# EAGLE design raspdancer11_1.0 (EAGLE 6.4)
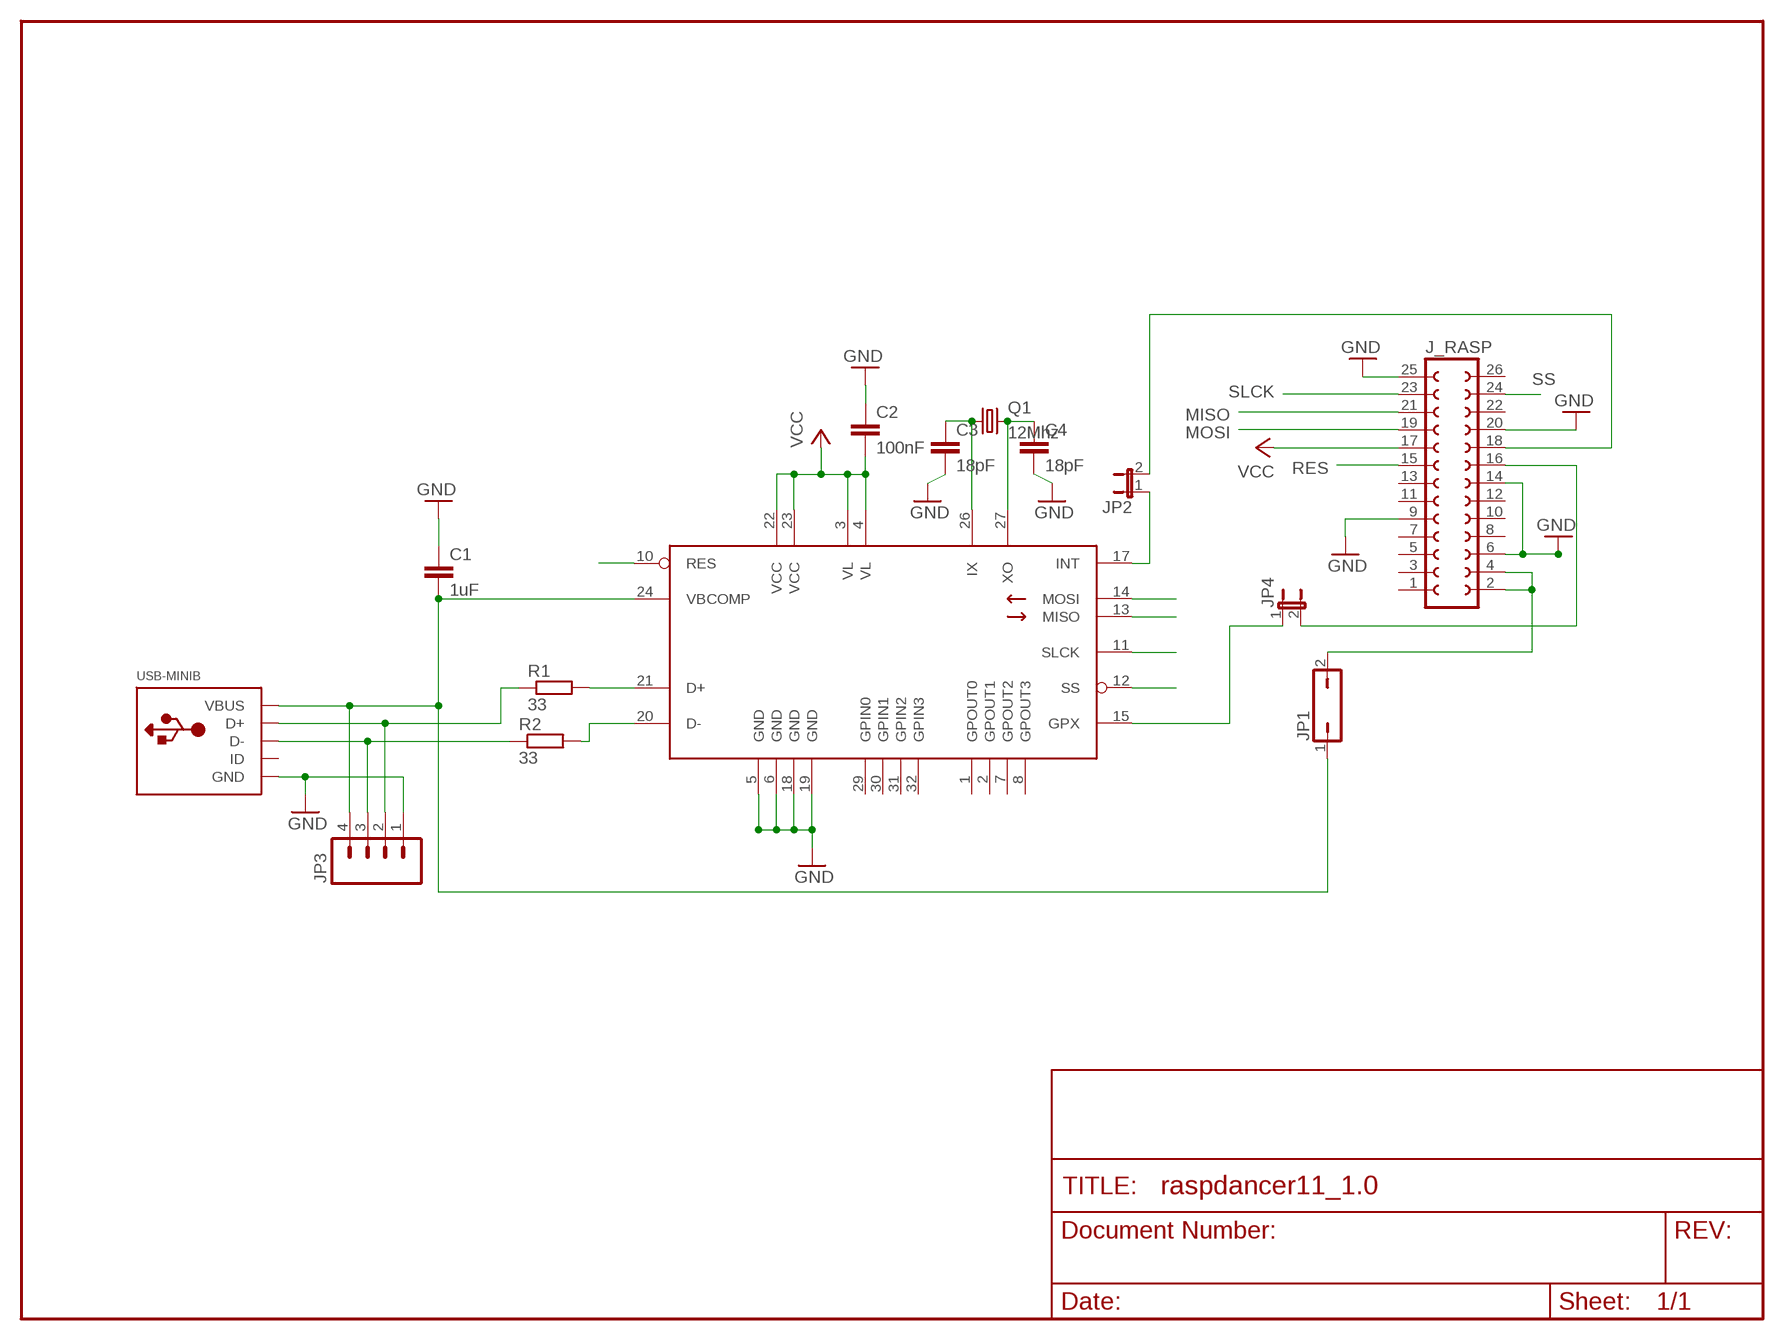
[diagram p0: schematic, sheet 1]

## Parts
C1  1uF  C1206  [C1206]
C2  100nF  C1206  [C1206]
C3  18pF  C1206  [C1206]
C4  18pF  C1206  [C1206]
J_RASP  FE13-2  [FE13-2]
JP1  JP1Q  [JP1]
JP2  JUMPER-2-OLDSMD-NO  [SJ_2S-NO]
JP3  M04PTH  [1X04]
JP4  JUMPER-2-OLDSMD-NO  [SJ_2S-NO]
Q1  12Mhz  CRYSTALCTS406  [CTS406]
R1  33  R1206  [R1206]
R2  33  R1206  [R1206]
U1  MAX3420  [TQFP32-08]
USB-MINIB  USBMINIB  [USB-MINIB]

## Nets
D+: R1.2 U1.21(D+)
D+2: JP3.2 R1.1 USB-MINIB.D+
D-: R2.2 U1.20(D-)
D-2: JP3.3 R2.1 USB-MINIB.D-
GND: C1.1 C2.1 C3.2 C4.2 J_RASP.6 J_RASP.9 J_RASP.14 J_RASP.20 J_RASP.25 JP3.1 U1.5(GND) U1.6(GND) U1.18(GND) U1.19(GND) USB-MINIB.GND
GPX: JP4.1 U1.15(GPX)
GPX2: J_RASP.16 JP4.2
INT: JP2.1 U1.17(INT)
INT2: J_RASP.18 JP2.2
IX: C3.1 Q1.1 U1.26(IX)
MISO: J_RASP.21 U1.13(MISO)
MOSI: J_RASP.19 U1.14(MOSI)
RES: J_RASP.15 U1.10(RES)
SLCK: J_RASP.23 U1.11(SLCK)
SS: J_RASP.24 U1.12(SS)
VBUS: C1.2 JP1.1 JP3.4 U1.24(VBCOMP) USB-MINIB.VBUS
VBUS2: J_RASP.2 J_RASP.4 JP1.2
VCC: C2.2 J_RASP.17 U1.3(VL) U1.4(VL) U1.22(VCC) U1.23(VCC)
XO: C4.1 Q1.3 U1.27(XO)
Unconnected: J_RASP.1 J_RASP.3 J_RASP.5 J_RASP.7 J_RASP.8 J_RASP.10 J_RASP.11 J_RASP.12 J_RASP.13 J_RASP.22 J_RASP.26 U1.1(GPOUT0) U1.2(GPOUT1) U1.7(GPOUT2) U1.8(GPOUT3) U1.29(GPIN0) U1.30(GPIN1) U1.31(GPIN2) U1.32(GPIN3) USB-MINIB.ID

## Library data of the parts
C1-C4 = 00_mylib:C
J_RASP = doegox:FE13-2: FEMALE HEADER; OC_FARNELL: unknown; OC_NEWARK: unknown
JP1 = jumper:JP1Q: JUMPER
JP2 JP4 = SparkFun:JUMPER-2-OLD: Jumper Basic 0.1" spaced jumper. Use with breakaway headers.
JP3 = SparkFun:M04: Header 4 Standard 4-pin 0.1" header. Use with straight break away headers (SKU : PRT-00116), right angle break away headers (PRT-00553), swiss pins (PRT-00743), machine pins (PRT-00117), and female headers (PRT-00115). Molex polarized connector foot print use with SKU : PRT-08231 with associated crimp pins and housings. 1MM SMD Version SKU: PRT-10208
Q1 = crystal:CRYSTAL: CRYSTAL; OC_FARNELL: unknown; OC_NEWARK: unknown
R1 R2 = 00_mylib:R: Resistance
U1 = maxim-2:MAX3420
USB-MINIB = adafruit:USB: USB Connectors USBMINIB - Surface Mount Female Mini-B USB Connector 4UConnector: 06564 By microbuilder.eu Thru-hole RA Female Mini-B USB Connector 4UConnector: 18732 By ladyada.net

## Board
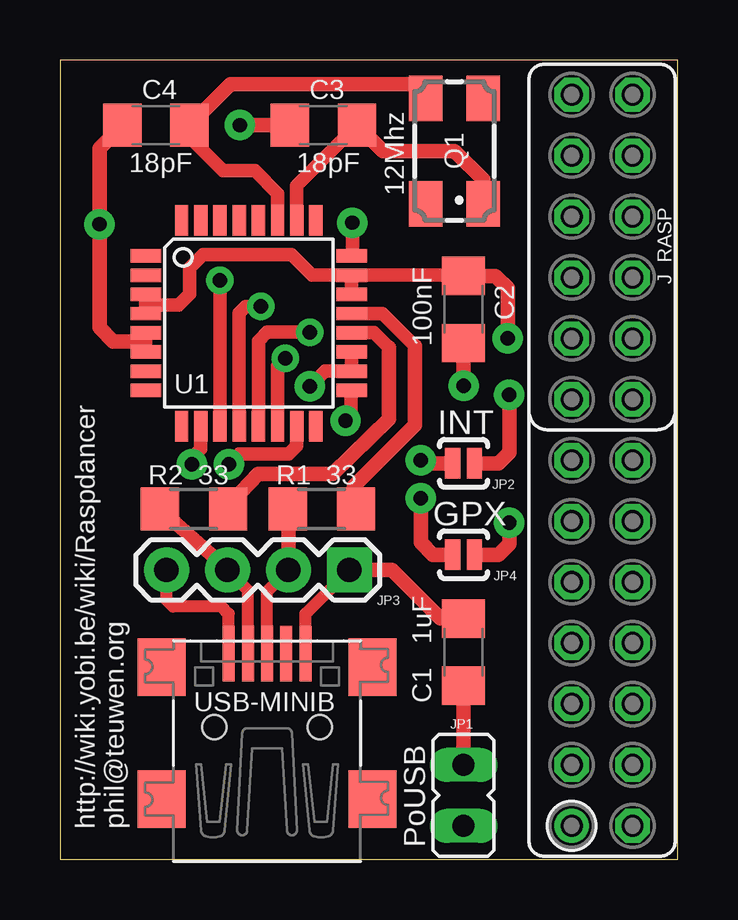
[diagram p1: board, top side]
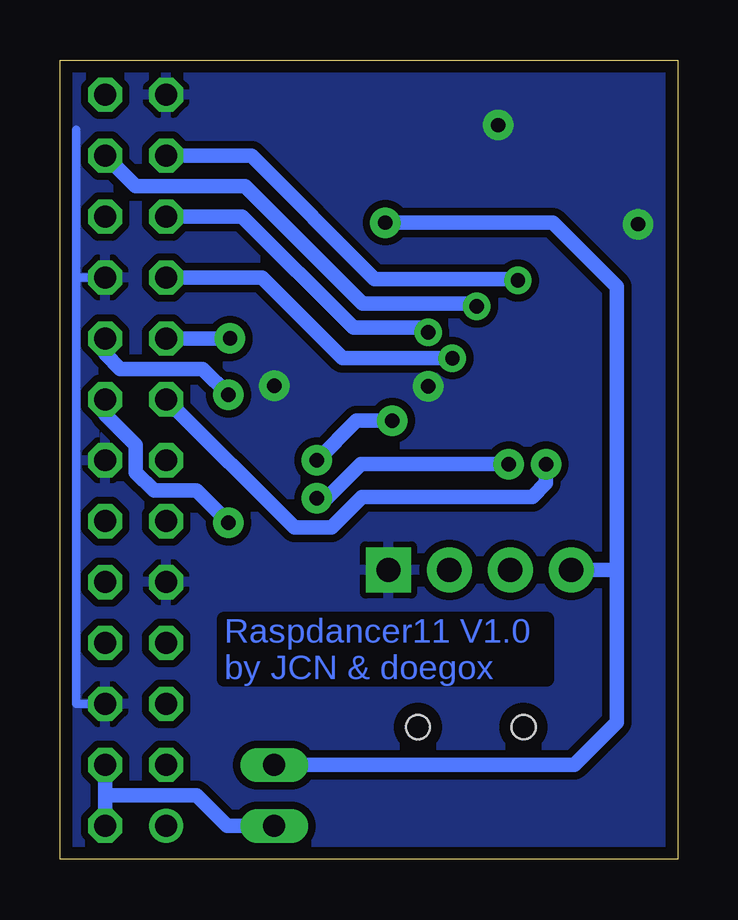
[diagram p2: board, bottom side, seen from below]

Size 25.76 x 33.33 mm. Coordinates in mm from the lower left corner, seen from the top.
Outline: 0,0 25.76,0 25.76,33.33 0,33.33 0,0
Copper layers (1*16): Top 0.035mm / dielectric 1.5mm / Bottom 0.035mm
Design rules "default *": minimum track width 10mil, minimum drill 23mil, track to track 8mil, track to pad 8mil, pad to pad 8mil, via to via 8mil, smd to smd 8mil, copper to edge 20mil, drill to drill 8mil, minimum pad ring 10mil, minimum via ring 8mil, stop-mask expansion 4mil, vias tented up to drill 25mil, thermal gap 10mil

### Footprints (pad centres in the part's own frame; a part is rotated, then mirrored left to right if it is on the bottom)
C1206 = smd 1.6 x 1.8: 1 -1.4,0; 2 1.4,0
FE13-2 = drill 0.914: 1 -15.24,1.27 | drill 0.914 octagon: 2 -15.24,-1.27; 3 -12.7,1.27; 4 -12.7,-1.27; 5 -10.16,1.27; 6 -10.16,-1.27; 7 -7.62,1.27; 8 -7.62,-1.27; 9 -5.08,1.27; 10 -5.08,-1.27; 11 -2.54,1.27; 12 -2.54,-1.27; 13 0,1.27; 14 0,-1.27; 15 2.54,1.27; 16 2.54,-1.27; 17 5.08,1.27; 18 5.08,-1.27; 19 7.62,1.27; 20 7.62,-1.27; 21 10.16,1.27; 22 10.16,-1.27; 23 12.7,1.27; 24 12.7,-1.27; 25 15.24,1.27; 26 15.24,-1.27
JP1 = drill 0.914 long: 1 0,-1.27; 2 0,1.27
SJ_2S-NO = smd 0.635 x 1.27: 1 -0.45,0; 2 0.45,0
1X04 = drill 1.016 pad 1.88 square: 1 0,0 | drill 1.016 pad 1.88: 2 2.54,0; 3 5.08,0; 4 7.62,0
CTS406 = smd 1.9 x 1.4: 1 -2.2,-1.2; 2 2.2,-1.2; 3 2.2,1.2; 4 -2.2,1.2
R1206 = smd 1.6 x 1.803: 1 -1.422,0; 2 1.422,0
TQFP32-08 = smd 1.27 x 0.559: 1 -4.293,2.8; 2 -4.293,2; 3 -4.293,1.2; 4 -4.293,0.4; 5 -4.293,-0.4; 6 -4.293,-1.2; 7 -4.293,-2; 8 -4.293,-2.8; 17 4.293,-2.8; 18 4.293,-2; 19 4.293,-1.2; 20 4.293,-0.4; 21 4.293,0.4; 22 4.293,1.2; 23 4.293,2; 24 4.293,2.8 | smd 0.559 x 1.27: 9 -2.8,-4.293; 10 -2,-4.293; 11 -1.2,-4.293; 12 -0.4,-4.293; 13 0.4,-4.293; 14 1.2,-4.293; 15 2,-4.293; 16 2.8,-4.293; 25 2.8,4.293; 26 2,4.293; 27 1.2,4.293; 28 0.4,4.293; 29 -0.4,4.293; 30 -1.2,4.293; 31 -2,4.293; 32 -2.8,4.293
USB-MINIB = smd 0.5 x 2.308: D+ 0,4.064; D- -0.8,4.064; GND 1.6,4.064; ID 0.8,4.064; VBUS -1.6,4.064 | smd 2 x 2.4: GND1 -4.4,-2; GND2 -4.4,3.5; GND3 4.4,3.5; GND4 4.4,-2 | hole 1: -2.2,1; 2.2,1

### Placement (x,y rotation side)
C1  16.83,8.64 270 top
C2  16.83,22.92 90 top
C3  10.99,30.61 180 top
C4  4,30.61 180 top
J_RASP  22.61,16.64 90 top
JP1  16.83,2.67 180 top
JP2  16.83,16.51 0 top
JP3  12.06,12.06 180 top
JP4  16.83,12.7 0 top
Q1  16.45,29.53 90 top
R1  10.92,14.61 0 top
R2  5.59,14.61 0 top
U1  7.87,22.35 0 top
USB-MINIB  8.64,4.51 0 top

### Tracks (layer width: path | path; a pad name or v marks a point on that pad's centre or on a via)
D+
  Top 0.559: 14.8,21.4 13.44,22.75 U1.21
  Top 0.61: R1.2 12.19,15.14 12.26,15.56 14.8,18.1 14.8,21.4
D+2
  Top 0.508: USB-MINIB.D+ 8.64,11.18 JP3.2
  Top 0.61: R1.1 9.53,14.96 JP3.2
D-
  Top 0.254: R2.2 7.62,15.24 7.54,15.31
  Top 0.559: U1.20 13.1,21.95 13.72,21.34
  Top 0.61: 13.72,21.34 13.72,18.35 11.37,16.07 8.26,16.07 7.54,15.31 7.24,14.99
D-2
  Top 0.508: USB-MINIB.D- 7.84,11.21 JP3.3
  Top 0.61: 7.01,12.06 JP3.3 7.01,12.09 R2.1
GND  (via drill 0.6 pad 1.27)
  Top 0.406: U1.19 12.17,20.42 12.13,20.38
  Top 0.508: USB-MINIB.GND 10.24,10.24 JP3.1
  Top 0.559: U1.19 U1.18 11.05,20.35 v10.41,19.72 | U1.6 3.58,21.18 U1.5
  Top 0.61: 3.58,21.18 3.17,21.59 2.22,21.59 1.65,22.16 v1.65,26.48 1.65,29.66 C4.2 | C3.2 v7.49,30.61 | C2.1 v16.83,19.75 | C1.1 15.87,10.04 13.84,12.06 JP3.1
  Bottom 0.356: J_RASP.20 25.07,24.26 | J_RASP.6 25.07,6.48 25.07,24.26 | 25.07,30.42 25.07,24.26
  Bottom 0.61: v16.83,19.75 16.83,19.81
  pour Bottom (isolate 0.305): 0,33.27 25.78,33.27 25.78,0 0,0
GPX  (via drill 0.6 pad 1.27)
  Top 0.559: U1.15 9.87,17.24 9.53,16.89 7.46,16.89 v7.05,16.48
  Top 0.61: v15.05,15.05 15.05,13.21 15.56,12.7 JP4.1
  Bottom 0.61: v15.05,15.05 14.64,15.05 13.21,16.48 v7.05,16.48
GPX2  (via drill 0.6 pad 1.27)
  Top 0.61: JP4.2 18.29,12.7 18.73,13.14 v18.73,14.03
  Bottom 0.61: J_RASP.16 23.88,18.54 22.61,17.27 22.61,16.13 21.84,15.37 20.07,15.37 v18.73,14.03
INT  (via drill 0.6 pad 1.27)
  Top 0.559: v11.91,18.29 12.13,18.51 12.13,19.51 U1.17
  Top 0.61: v15.05,16.64 15.08,16.64 15.21,16.51 JP2.1
  Bottom 0.61: v15.05,16.64 13.4,18.29 v11.91,18.29
INT2  (via drill 0.6 pad 1.27)
  Top 0.61: JP2.2 18.29,16.51 18.73,16.95 v18.73,19.37
  Bottom 0.61: J_RASP.18 23.88,21.08 23.24,20.45 19.81,20.45 v18.73,19.37
IX
  Top 0.559: U1.26 9.87,28.1 C3.1
  Top 0.61: Q1.1 17.65,28.33 16.45,29.53 13.46,29.53 C3.1
MISO  (via drill 0.6 pad 1.14)
  Top 0.559: U1.13 8.27,21.61 8.64,21.97 v10.41,21.97
  Bottom 0.61: J_RASP.21 18.16,26.8 13.53,22.16 10.6,22.16 v10.41,21.97
MOSI  (via drill 0.6 pad 1.14)
  Top 0.559: U1.14 9.07,20.57 v9.4,20.89
  Bottom 0.61: v9.4,20.89 13.97,20.89 17.34,24.26 J_RASP.19
RES  (via drill 0.6 pad 1.27)
  Top 0.559: v5.49,16.48 5.49,16.73 5.87,17.11 5.88,18.07 U1.10
  Bottom 0.61: J_RASP.15 15.97,13.84 14.45,13.84 13.18,15.11 6.06,15.11 5.49,15.68 v5.49,16.48
SLCK  (via drill 0.6 pad 1.14)
  Top 0.559: U1.11 6.67,23.76 v6.67,24.13
  Bottom 0.61: J_RASP.23 17.78,29.34 12.64,24.19 6.73,24.19 v6.67,24.13
SS  (via drill 0.6 pad 1.14)
  Top 0.559: U1.12 7.47,22.78 7.75,23.05 v8.38,23.05
  Bottom 0.61: J_RASP.24 22.61,28.07 18.03,28.07 13.14,23.18 8.51,23.18 v8.38,23.05
VBUS  (via drill 0.6 pad 1.27)
  Top 0.406: U1.24 12.19,25.15
  Top 0.508: USB-MINIB.VBUS 7.04,10.24 6.73,10.54 4.7,10.54 4.45,10.79 JP3.4
  Top 0.559: 12.19,25.15 v12.19,26.54
  Top 0.61: 4.45,12 JP3.4 | JP1.1 C1.2
  Bottom 0.61: v12.19,26.54 5.21,26.54 2.54,23.88 2.54,12 | 2.54,12 2.54,5.71 4.32,3.94 JP1.1 | JP3.4 2.6,12.06 2.54,12
VBUS2
  Bottom 0.61: J_RASP.4 23.88,2.67 | 23.88,2.67 J_RASP.2 | JP1.2 18.8,1.4 20.07,2.67 23.88,2.67
VCC  (via drill 0.6 pad 1.27)
  Top 0.559: U1.3 U1.4 3.94,23.11 4.95,23.11 5.4,23.56 5.4,24.64 5.97,25.21 9.65,25.21 10.51,24.35 U1.23 | U1.23 16.8,24.35 C2.2 | U1.23 U1.22
  Top 0.61: C2.2 18.16,24.32 18.67,23.81 v18.67,21.72
  Bottom 0.61: v18.67,21.72 J_RASP.17
XO
  Top 0.559: U1.27 9.07,27.74 9.08,27.75 8.13,28.7 6.79,28.7 5.4,30.1
  Top 0.61: Q1.3 15.25,32.31 15.24,32.32 7.12,32.32 C4.1 5.4,30.1

### Text on the board
Bottom: Raspdancer11 V1.0 / by JCN & doegox
tPlace: INT | GPX | http://wiki.yobi.be/wiki/Raspdancer / phil@teuwen.org | PoUSB